# Altium schematic sheet Buzzer.SchDoc
size A4
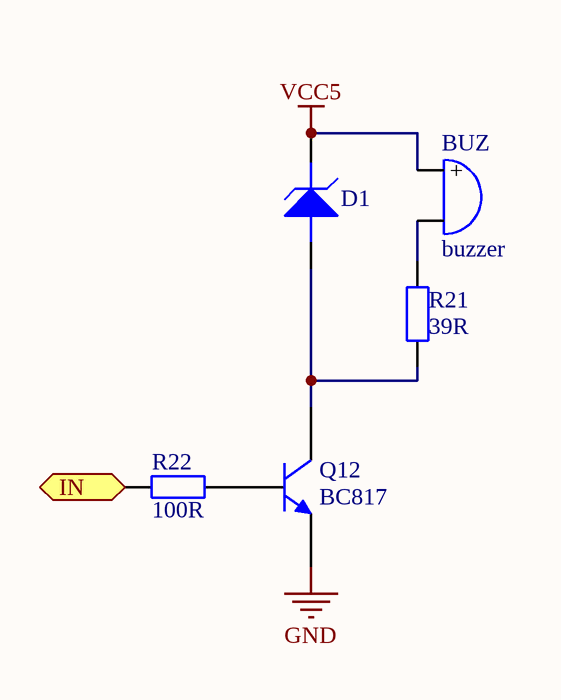
[diagram p0: Buzzer.SchDoc]

## Parts
BUZ  buzzer  [buzzer]
D1  TRANS SUPPR  [FP_SMA]  (value not drawn)
Q12  BC817  [FP_SOT23-3]
R21  39R  [FP_0805_RES]
R22  100R  [FP_0805_RES]

## Ports
IN (in)

## Nets
GND: Q12.1(E)
VCC5: BUZ.1(+) D1.1(CATHODE)
IN: R22.1 ; port IN
NetBUZ_2: BUZ.2(-) R21.2
NetD1_2: D1.2(ANODE) Q12.3(C) R21.1
NetQ12_2: Q12.2(B) R22.2

## Library data of the parts
BUZ = buzzer: Name: Electro Mechanical Transducer; Reference: 2361105; Supplier: Farnell; Link: http://hu.farnell.com/multicomp/mcabt-408-rc/sounder-electro-mech-audio-1-5vp/dp/2361105
D1 = TRANS SUPPR: Transient suppressor; pin to pad: 1>2 2>1; Reference: 1827607; Name: LITTELFUSE  SMAJ5.0A  TVS Diode, TRANSZORB SMAJ Series, Unidirectional, 5 V; Voltage: 5V; Supplier: Farnell
Q12 = BC817: NPN Transistor; pin to pad: 1>2 2>1; Reference: 1081224; Name: BC817-25,215  Bipolar (BJT) Single Transistor, General Purpose, NPN, 45 V, 100 MHz; Supplier: Farnell
R21 = RES 39R: Resistor; Tolerance: 5%; Power: 125mW; Name: WALSIN  WR08X390 JTL  SMD Chip Resistor, 39 ohm; Reference: 2671027; Supplier: Farnell; Value: 39R
R22 = RES 100R: Resistor; Tolerance: 5%; Power: 125mW; Name: YAGEO (PHYCOMP)  RC0805JR-07100RL  SMD Chip Resistor, Thick Film, 100 ohm,; Reference: 9233881; Supplier: Farnell; Value: 100R